# Altium schematic sheet IMU.SchDoc
size A; SheetNumber: 9; SheetTotal: 9
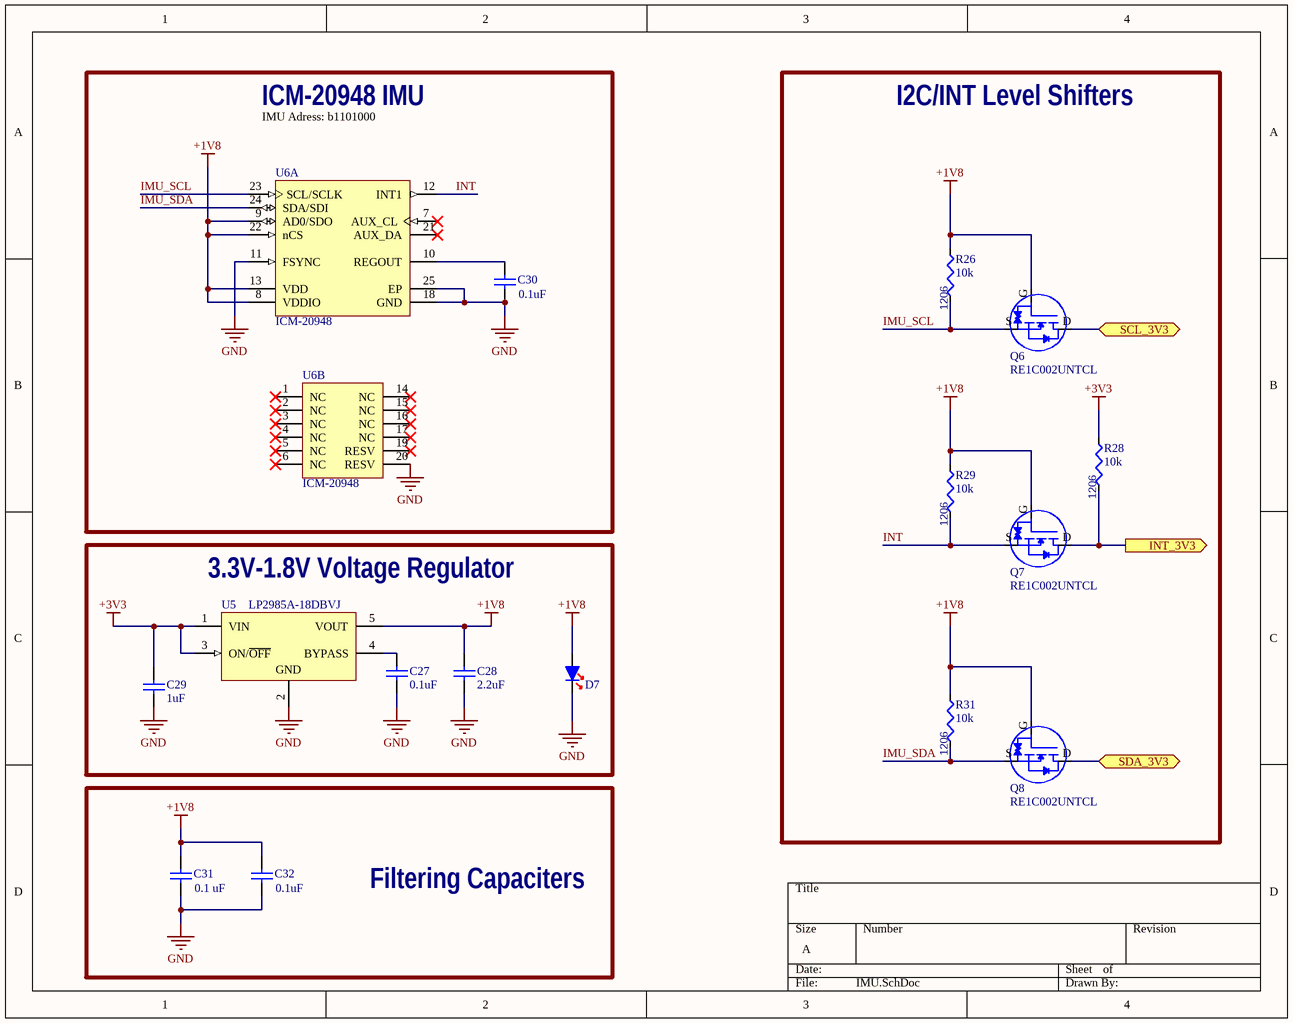
[diagram p0: IMU.SchDoc]

## Parts
C27  0.1uF  [GMC10X7R104J10NT-Footprint-1]
C28  2.2uF  [C1206]
C29  1uF  [C1206]
C30  0.1uF  [GMC10X7R104J10NT-Footprint-1]
C31  0.1 uF  [GMC10X7R104J10NT-Footprint-1]
C32  0.1uF  [GMC10X7R104J10NT-Footprint-1]
D7  AA3528LSECKT/J3  [New footprint 1]  (value not drawn)
Q6  RE1C002UNTCL  [DIO_RB558WMF_ROM]
Q7  RE1C002UNTCL  [DIO_RB558WMF_ROM]
Q8  RE1C002UNTCL  [DIO_RB558WMF_ROM]
R26  10k  [R1206]
R28  10k  [R1206]
R29  10k  [R1206]
R31  10k  [R1206]
U5  LP2985A-18DBVJ  [DBV0005A_L]
U6  ICM-20948  [TDK-QFN-24_L]  (parts A,B of 2)

## Blocks framed on the sheet
ICM-20948 IMU: C30 U6
I2C/INT Level Shifters: Q6-Q8 R26 R28 R29 R31
3.3V-1.8V Voltage Regulator: C27-C29 D7 U5
Filtering Capaciters: C31 C32

## Ports
INT_3V3 (out), SCL_3V3 (bidir), SDA_3V3 (bidir)

## Nets
+1V8: C28.2 C31.2 C32.2 D7.2 Q6.G Q7.G Q8.G R26.2 R29.2 R31.2 U5.5(VOUT) U6.8(VDDIO) U6.9(AD0/SDO) U6.13(VDD) U6.22(nCS)
+3V3: C29.2 R28.2 U5.1(VIN) U5.3(ON/~{OFF})
GND: C27.1 C28.1 C29.1 C30.1 C31.1 C32.1 D7.1 U5.2(GND) U6.11(FSYNC) U6.18(GND) U6.20(RESV) U6.25(EP)
IMU_SCL: Q6.S R26.1 U6.23(SCL/SCLK)
IMU_SDA: Q8.S R31.1 U6.24(SDA/SDI)
INT: Q7.S R29.1 U6.12(INT1)
INT_3V3: Q7.D R28.1 ; port INT_3V3
SCL_3V3: Q6.D ; port SCL_3V3
SDA_3V3: Q8.D ; port SDA_3V3
NetC27_2: C27.2 U5.4(BYPASS)
NetC30_2: C30.2 U6.10(REGOUT)

Not connected (* = marked no-connect by the designer): U6 1(NC)* 2(NC)* 3(NC)* 4(NC)* 5(NC)* 6(NC)* 7(AUX_CL)* 14(NC)* 15(NC)* 16(NC)* 17(NC)* 19(RESV)* 21(AUX_DA)*

## Notes on the sheet
- IMU Adress: b1101000
- (in symbol CMP-024-000034-3) 1206

## Library data of the parts
C27 C30-C32 = 2571-GMC10X7R104J10NTTR-ND-14: 0.1 µF ±5% 10V Ceramic Capacitor X7R 0603 (1608 Metric)
C28 = CMP-054-000016-3: CAP CER 2.2UF 50V X7R 1206; Source: Capacitors.SchLib; Design Item ID: CL31B225KBHNNNE
C29 = CMP-054-000013-4: CER 1UF 50V X7R 1206; Reviewed by: Carter Allen; Made by: Brennan Swanton; Supplier Part Number 1: 399-C1206C105K5RAC7800CT-ND; Supplier 1: Digi-Key; Source: Capacitors.SchLib; Design Item ID: CL31B105KBHNNNE
D7 = CMP-00002-6: Red 625nm LED Indication - Discrete 1.8V 2-PLCC
Q6-Q8 = RE1C002UNTCL: No Description Available; Mfr_Name: ROHM Semiconductor; Type: DEV; Copyright: Copyright (C) 2024 Ultra Librarian. All rights reserved.; Manufacturer_Part_Number: RE1C002UNTCL; RefDes: RefDes
R26 R28 R29 R31 = CMP-024-000034-3: 10K OHM 1% 1/4W 1206; Made By: Brennan Swanton; Reviewed By: Carter Allen; Supplier 1: Digi-Key; Supplier Part Number 1: 541-2247-1-ND; Source: Resistors.SchLib; Design Item ID: ERJ-8ENF1002V
U5 = CMP-0758-00071-2: Single Output Low Noise LDO, 150 mA, Fixed 1.8 V Output, 1% Tolerance, 2.2 to 16 V Input, Low IQ, 5-Pin SOT-23 (DBV), -40 to 125 degC, Green (RoHS & no Sb/Br), Tape and Reel; Manufacturer: Texas Instruments; Fixed Output Options (V): 1.8; Iq (Typ) (mA): 0.85; Accuracy (%): 1; Output Options: Fixed Output; Vdo (Typ) (mV): 280; Iout (Max) (A): 0.15; RoHS: TRUE; PackageReference: DBV0005A; ComponentLink3Description: Package Specification; DatasheetVersion: SLVS522N; ComponentLink1Description: Manufacturer URL; PackageVersion: 4073253-4/L; PackageDescription: 5-Pin Plastic Small Outline, Body 2.9 x 1.6 mm, Pitch 0.95 mm; ComponentLink2URL: http://www.ti.com/lit/ds/symlink/lp2985-50.pdf; Mounting Technology: Surface Mount; Packing: Tape and Reel; Vin (V): 2.2 to 16; ComponentLink2Description: Datasheet; ComponentLink3URL: http://www.ti.com/litv/pdf/mpds018j; Operating Temperature Range (degC): -40 to 125; PartNumber: LP2985A-18DBVJ; ComponentLink1URL: http://www.ti.com/
U6 = CMP-2000-07532-1: World’s Lowest Power 9-Axis MEMS MotionTracking(TM) Device, 1.71 to 3.6 V, -40 to 85 degC, 24-Pin QFN, RoHS, Tape and Reel; Manufacturer: TDK; Package Description: 24-Pin Quad Flat No-lead Package, Body 3 x 3 mm, Pitch 0.4 mm; Datasheet Version: Rev. 1.3, 06/2017; Package Reference: QFN-24; Mounting Technology: SurfaceMount; Datasheet URL: https://www.invensense.com/wp-content/uploads/2016/06/DS-000189-ICM-20948-v1.3.pdf; Manufacturer URL: http://www.tdk.com/